# Altium schematic sheet MCU_buck.SchDoc: Buck Converter 20V 60W
size A4; Date: 25 FEB 2024; Author: Arturo S. Bayangos; Revision: V1.0; SheetNumber: 4; SheetTotal: 4
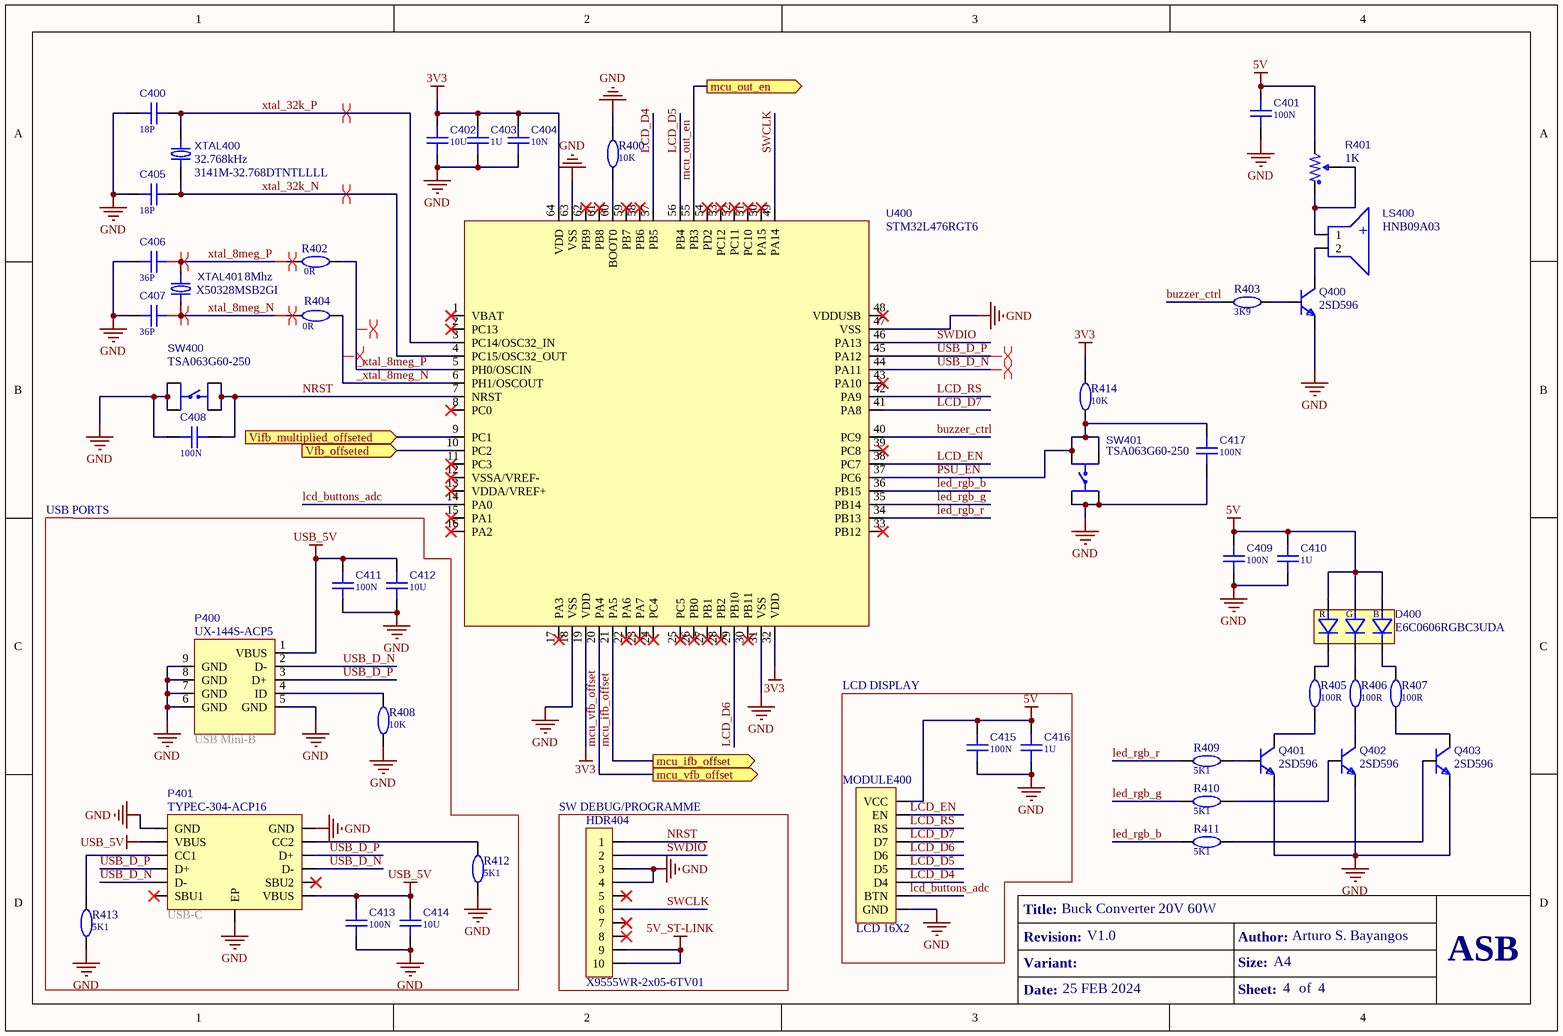
[diagram p0: MCU_buck.SchDoc]

## Parts
C400  value 18P  [CAP_0603]  (hidden comment: CAPACITOR)
C401  value 100N  [CAP_0402]  (hidden comment: CAPACITOR)
C402  value 10U  [CAP_1210]  (hidden comment: CAPACITOR)
C403  value 1U  [CAP_0603]  (hidden comment: CAPACITOR)
C404  value 10N  [CAP_0402]  (hidden comment: CAPACITOR)
C405  value 18P  [CAP_0603]  (hidden comment: CAPACITOR)
C406  value 36P  [CAP_0402]  (hidden comment: CAPACITOR)
C407  value 36P  [CAP_0402]  (hidden comment: CAPACITOR)
C408  value 100N  [CAP_0402]  (hidden comment: CAPACITOR)
C409  value 100N  [CAP_0402]  (hidden comment: CAPACITOR)
C410  value 1U  [CAP_0603]  (hidden comment: CAPACITOR)
C411  value 100N  [CAP_0402]  (hidden comment: CAPACITOR)
C412  value 10U  [CAP_1210]  (hidden comment: CAPACITOR)
C413  value 100N  [CAP_0402]  (hidden comment: CAPACITOR)
C414  value 10U  [CAP_1210]  (hidden comment: CAPACITOR)
C415  value 100N  [CAP_0402]  (hidden comment: CAPACITOR)
C416  value 1U  [CAP_0603]  (hidden comment: CAPACITOR)
C417  value 100N  [CAP_0402]  (hidden comment: CAPACITOR)
D400  value E6C0606RGBC3UDA  [LED_0603]  (hidden comment: LED_RGB_COMMON_P)
HDR404  value X9555WR-2x05-6TV01  [SOCKET_2X5P_2.54mm_HORZ_X9555WR]  (hidden comment: HEADER_2X5P_2.54mm)
LS400  value HNB09A03  [BUZZER_HNB09A03]  (hidden comment: BUZZER)
MODULE400  value LCD 16X2  [LCD_MODULE_16X2]  (hidden comment: LCD_MODULE_16X2)
P400  value UX-144S-ACP5  [USB_Mini-B_UX-144S-ACP5]  (hidden comment: USB_Mini-B)
P401  value TYPEC-304-ACP16  [USB-C_2.0_12PIN]  (hidden comment: USB-C_2.0)
Q400  value 2SD596  [SOT-23]  (hidden comment: BJT_NPN)
Q401  value 2SD596  [SOT-23]  (hidden comment: BJT_NPN)
Q402  value 2SD596  [SOT-23]  (hidden comment: BJT_NPN)
Q403  value 2SD596  [SOT-23]  (hidden comment: BJT_NPN)
R400  value 10K  [RES_0603]  (hidden comment: RESISTOR)
R401  value 1K  [RES_GF063P1-B102]  (hidden comment: RESISTOR_POT)
R402  value 0R  [RES_0402]  (hidden comment: RESISTOR)
R403  value 3K9  [RES_0603]  (hidden comment: RESISTOR)
R404  value 0R  [RES_0402]  (hidden comment: RESISTOR)
R405  value 100R  [RES_0603]  (hidden comment: RESISTOR)
R406  value 100R  [RES_0603]  (hidden comment: RESISTOR)
R407  value 100R  [RES_0603]  (hidden comment: RESISTOR)
R408  value 10K  [RES_0603]  (hidden comment: RESISTOR)
R409  value 5K1  [RES_0402]  (hidden comment: RESISTOR)
R410  value 5K1  [RES_0402]  (hidden comment: RESISTOR)
R411  value 5K1  [RES_0402]  (hidden comment: RESISTOR)
R412  value 5K1  [RES_0402]  (hidden comment: RESISTOR)
R413  value 5K1  [RES_0402]  (hidden comment: RESISTOR)
R414  value 10K  [RES_0603]  (hidden comment: RESISTOR)
SW400  value TSA063G60-250  [SMD_TSA063G60-250]  (hidden comment: SWITCH_SPST)
SW401  value TSA063G60-250  [SMD_TSA063G60-250]  (hidden comment: SWITCH_SPST)
U400  value STM32L476RGT6  [LQFP-64]  (hidden comment: MCU_STM32L476RGT6)
XTAL400  value 3141M-32.768DTNTLLLL  Frequency: 32.768kHz  [SMD_W1.5mm_L4.1mm_3141M-32.768DTNTLLLL]  (hidden comment: XTAL)
XTAL401  value X50328MSB2GI  Frequency: 8Mhz  [SMD_W3.2mm_L5.0m_X50328MSB2GI]  (hidden comment: XTAL)

## Blocks framed on the sheet
LCD DISPLAY: C415 C416 MODULE400
SW DEBUG/PROGRAMME: HDR404

## Ports
mcu_ifb_offset (out), mcu_out_en (out), mcu_vfb_offset (out), Vfb_offseted (in), Vifb_multiplied_offseted (in)

## Nets
3V3: C402.2 C403.2 C404.2 R414.2 U400.19(VDD) U400.32(VDD) U400.64(VDD)
5V: C401.2 C409.2 C410.2 C415.2 C416.2 D400.2(P) MODULE400.5(VCC) R401.3
5V_ST-LINK: HDR404.9 HDR404.10
GND: C400.1 C401.1 C402.1 C403.1 C404.1 C405.1 C406.1 C407.1 C408.1 C409.1 C410.1 C411.1 C412.1 C413.1 C414.1 C415.1 C416.1 C417.2 HDR404.3 HDR404.4 MODULE400.6(GND) P400.5(GND) P400.6(GND) P400.7(GND) P400.8(GND) P400.9(GND) P401.A1B12(GND) P401.B1A12(GND) P401.EP Q400.2(E) Q401.2(E) Q402.2(E) Q403.2(E) R400.2 R408.1 R412.2 R413.2 SW400.3 SW400.4 SW401.3 SW401.4 U400.18(VSS) U400.31(VSS) U400.47(VSS) U400.63(VSS)
USB_5V: C411.2 C412.2 C413.2 C414.2 P400.1(VBUS) P401.A4B9(VBUS) P401.B4A9(VBUS)
_xtal_8meg_N: R404.2 U400.6(PH1/OSCOUT)
_xtal_8meg_P: R402.2 U400.5(PH0/OSCIN)
buzzer_ctrl: R403.1 U400.40(PC9)
lcd_buttons_adc: MODULE400.7(BTN) U400.14(PA0)
LCD_D4: MODULE400.17(D4) U400.57(PB5)
LCD_D5: MODULE400.18(D5) U400.56(PB4)
LCD_D6: MODULE400.19(D6) U400.29(PB10)
LCD_D7: MODULE400.20(D7) U400.41(PA8)
LCD_EN: MODULE400.22(EN) U400.38(PC7)
LCD_RS: MODULE400.21(RS) U400.42(PA9)
led_rgb_b: R411.1 U400.36(PB15)
led_rgb_g: R410.1 U400.35(PB14)
led_rgb_r: R409.1 U400.34(PB13)
mcu_ifb_offset: U400.21(PA5) ; port mcu_ifb_offset
mcu_out_en: U400.55(PB3) ; port mcu_out_en
mcu_vfb_offset: U400.20(PA4) ; port mcu_vfb_offset
NRST: C408.2 HDR404.1 SW400.1 SW400.2 U400.7(NRST)
PSU_EN: C417.1 R414.1 SW401.1 SW401.2 U400.37(PC6)
SWCLK: HDR404.6 U400.49(PA14)
SWDIO: HDR404.2 U400.46(PA13)
USB_D_N: P400.2(D-) P401.A7(D-) P401.B7(D-) U400.44(PA11)
USB_D_P: P400.3(D+) P401.A6(D+) P401.B6(D+) U400.45(PA12)
Vfb_offseted: U400.10(PC2) ; port Vfb_offseted
Vifb_multiplied_offseted: U400.9(PC1) ; port Vifb_multiplied_offseted
xtal_8meg_N: C407.2 R404.1 XTAL401.1
xtal_8meg_P: C406.2 R402.1 XTAL401.2
xtal_32k_N: C405.2 U400.4(PC15/OSC32_OUT) XTAL400.2
xtal_32k_P: C400.2 U400.3(PC14/OSC32_IN) XTAL400.1
NetD400_1: D400.1(B) R407.2
NetD400_3: D400.3(G) R406.2
NetD400_4: D400.4(R) R405.2
NetLS400_1: LS400.1 R401.1 R401.2
NetLS400_2: LS400.2 Q400.3(C)
NetP400_4: P400.4(ID) R408.2
NetP401_A5: P401.A5(CC1) R413.1
NetP401_B5: P401.B5(CC2) R412.1
NetQ400_1: Q400.1(B) R403.2
NetQ401_1: Q401.1(B) R409.2
NetQ401_3: Q401.3(C) R405.1
NetQ402_1: Q402.1(B) R410.2
NetQ402_3: Q402.3(C) R406.1
NetQ403_1: Q403.1(B) R411.2
NetQ403_3: Q403.3(C) R407.1
NetR400_1: R400.1 U400.60(BOOT0)

Not connected (* = marked no-connect by the designer): HDR404 5* 7* 8*; P401 A8(SBU1)* B8(SBU2)*; U400 1(VBAT)* 2(PC13)* 8(PC0)* 11(PC3)* 12(VSSA/VREF-)* 13(VDDA/VREF+)* 15(PA1)* 16(PA2)* 17(PA3)* 22(PA6)* 23(PA7)* 24(PC4)* 25(PC5)* 26(PB0)* 27(PB1)* 28(PB2)* 30(PB11)* 33(PB12)* 39(PC8)* 43(PA10)* 48(VDDUSB)* 50(PA15)* 51(PC10)* 52(PC11)* 53(PC12)* 54(PD2)* 58(PB6)* 59(PB7)* 61(PB8)* 62(PB9)*

## Layout directives
differential pair: (no net found under the mark), _xtal_8meg_N, _xtal_8meg_P, USB_D_N, USB_D_P, xtal_8meg_N, xtal_8meg_P, xtal_32k_N, xtal_32k_P

## Notes on the sheet
- USB PORTS
- (near P400) USB Mini-B
- (near P401) USB-C
- Title:
- Revision:
- Variant:
- Size:
- Author:
- A4
- ASB
- Date:
- Sheet:
- of
- (in symbol HNB09A03) +

## Library data of the parts
C400 C405 = CC0603JRNPO9BN180: CAP 18P 0603 NPO 50V 5%; Manifacturer: YAGEO; Part Number: CC0603JRNPO9BN180; ComponentLink1Description: Datasheet; ComponentLink1URL: https://datasheet.lcsc.com/lcsc/2304140030_YAGEO-CC0603JRNPO9BN180_C107040.pdf; ComponentLink2Description: Characteristics; Package: 0603
C401 C408 C409 C411 C413 C415 C417 = UMK105B7104KV-FR: CAP 100N 0402 X7R 50V 10%; Manifacturer: Taiyo Yuden; Part Number: UMK105B7104KV-FR; ComponentLink1Description: Datasheet; ComponentLink1URL: https://datasheet.lcsc.com/lcsc/2211282030_Taiyo-Yuden-UMK105B7104KV-FR_C2167491.pdf; ComponentLink2Description: Characteristics; ComponentLink2URL: Datasheets\Capacitors\UMK105B7104KV-FR_TaiyoYuden.pdf; Package: 0402
C402 C412 C414 = UMK325AB7106KM-T: CAP 10U 1210 X7R 50V 10%; Manifacturer: Taiyo Yuden; Part Number: UMK325AB7106KM-T; ComponentLink1Description: Datasheet; ComponentLink1URL: https://datasheet.lcsc.com/lcsc/2211282230_Taiyo-Yuden-UMK325AB7106KM-T_C386167.pdf; ComponentLink2Description: Characteristics; ComponentLink2URL: Datasheets\Capacitors\UMK325AB7106KM-T_TaiyoYuden_Char.pdf; Package: 1210
C403 C410 C416 = TMK107AB7105KAHT: CAP 1U 0603 X7R 25V 10%; Manifacturer: Taiyo Yuden; Part Number: TMK107AB7105KAHT; ComponentLink1Description: Datasheet; ComponentLink1URL: https://datasheet.lcsc.com/lcsc/1912111437_Taiyo-Yuden-TMK107AB7105KAHT_C386079.pdf; ComponentLink2Description: Characteristics; ComponentLink2URL: Datasheets\Capacitors\TMK107AB7105KAHT_TaiyoYuden.pdf; Package: 0603
C404 = UMF105B7103KVHF: CAP 10N 0402 X7R 50V 10%; Manifacturer: Taiyo Yuden; Part Number: UMF105B7103KVHF; ComponentLink1Description: Datasheet; ComponentLink1URL: https://datasheet.lcsc.com/lcsc/1912111437_Taiyo-Yuden-UMF105B7103KVHF_C386105.pdf; ComponentLink2Description: Characteristics; ComponentLink2URL: Datasheets\Capacitors\UMF105B7103KVHF_TaiyoYuden.pdf; Package: 0402
C406 C407 = CC0603JRNPO9BN360: CAP 36P 0402 NPO 50V 5%; Manifacturer: YAGEO; Part Number: CC0603JRNPO9BN360; ComponentLink1Description: Datasheet; ComponentLink1URL: https://datasheet.lcsc.com/lcsc/2304140030_YAGEO-CC0603JRNPO9BN360_C134070.pdf; Package: 402
D400 = E6C0606RGBC3UDA: LED E6C0606RGBC3UDA 0603 RGB 5V 20mA; Forward voltage: 2.20V (max, red), 3.40V (max , green), 3.40V (max, blue); Manifacturer: EKINGLUX; Part Number: E6C0606RGBC3UDA; Package: 0603; Type: RGB; Current: 20mA; Voltage: 5V; Operating temperature: 90 ℃; ComponentLink1Description: Datasheet; ComponentLink1URL: https://datasheet.lcsc.com/lcsc/2203301730_EKINGLUX-E6C0606RGBC3UDA_C375569.pdf
HDR404 = X9555WR-2x05-6TV01: SOCKET / X9555WR-2x05-6TV01 TH 2.54mm 2X5P HORZ; Current: 3A; Manifacturer: XKB Connectivity; Part Number: X9555WR-2x05-6TV01; Package: TH; Pitch: 2.54mm; Voltage: N/A; Structure: 2X5P HORZ; Supported protocol: N/A; ComponentLink1Description: Datasheet; ComponentLink1URL: https://datasheet.lcsc.com/lcsc/2110112030_XKB-Connectivity-X9555WR-2x05-6TV01_C2682217.pdf
LS400 = HNB09A03: BUZZER HNB09A03 TH 1.5V-5V 3Khz; Current: 30mA; Supply Voltage: 1.5V - 4.5V; Tj: 20℃~+70℃; Manifacturer: Jiangsu Huaneng Elec; Part Number: HNB09A03; Package: TH; ComponentLink1Description: Datasheet; ComponentLink1URL: https://datasheet.lcsc.com/lcsc/1811141116_Jiangsu-Huaneng-Elec-HNB09A03_C96102.pdf; ComponentLink2Description: Characteristics
MODULE400 = LCD_16X2_Arduino_Shield: LCD Display 16X2 Arduino Shield; Part Number: LCD_16X2_Arduino_Shield; ComponentLink1Description: Datasheet; ComponentLink1URL: NA
P400 = UX-144S-ACP5: CONN UX-144S-ACP5 SMD USB_Mini-B 2.0; Current: 1.5A; Structure: USB Mini-B; Supported protocol: USB 2.0; Manifacturer: XUNPU; Part Number: UX-144S-ACP5; Package: SMD; Pitch: N/A; Voltage: N/A; ComponentLink1Description: Datasheet; ComponentLink1URL: https://datasheet.lcsc.com/lcsc/2008122036_XUNPU-UX-144S-ACP5_C720611.pdf
P401 = TYPEC-304-ACP16: CONN TYPEC-304-ACP16 SMD USB-C 2.0; Current: 3A; Supported protocol: USB 2.0; Manifacturer: XUNPU; Part Number: TYPEC-304-ACP16; Package: SMD; Pitch: N/A; Voltage: N/A; Structure: USB-C; ComponentLink1Description: Datasheet; ComponentLink1URL: https://datasheet.lcsc.com/lcsc/2203111830_XUNPU-TYPEC-304-ACP16_C2982555.pdf
Q400-Q403 = 2SD596: NPN 2SD596 SOT-23 25V 0.2W; VEBO: 5V; Tjmax: 150 °C; Manifacturer: YONGYUTAI; ComponentLink1Description: Datasheet; ComponentLink1URL: https://datasheet.lcsc.com/lcsc/2109011130_YONGYUTAI-2SD596_C2891824.pdf; Part Number: 2SD596; Package: SOT-23; VCEO: 25V; Power: 0.2W
R400 R408 R414 = ARG03BTC1002: RES 10K 0603 0.1W 0.1% 75V; Manifacturer: Viking Tech; Part Number: ARG03BTC1002; ComponentLink1Description: Datasheet; ComponentLink1URL: Datasheets\Resistors\ARG03BTC1002_VikingTech.pdf; ComponentLink2Description: Characteristics; Package: 0603
R401 = GF063P1-B102: RES POT 1K TH 20%; Manifacturer: Tokyo Cosmos Elec; ComponentLink1Description: Datasheet; ComponentLink1URL: https://datasheet.lcsc.com/lcsc/2304140030_Tokyo-Cosmos-Elec-GF063P1-B102_C128078.pdf; ComponentLink2Description: Characteristics; Part Number: GF063P1-B102; Package: TH
R402 R404 = 0402WGF0000TCE: RES 0R 0402 1% 0.625W; Manifacturer: UNI-ROYAL(Uniroyal Elec); Part Number: 0402WGF0000TCE; ComponentLink1Description: Datasheet; ComponentLink1URL: https://datasheet.lcsc.com/lcsc/2206010216_UNI-ROYAL-Uniroyal-Elec-0402WGF0000TCE_C17168.pdf; Package: 402
R403 = RC0603FR-073K9L: RES 3K9 0603 1% 0.1W 75V; Manifacturer: YAGEO; Part Number: RC0603FR-073K9L; ComponentLink1Description: Datasheet; ComponentLink1URL: https://datasheet.lcsc.com/lcsc/2304140030_YAGEO-RC0603FR-073K9L_C114616.pdf; ComponentLink2Description: Characteristics; Package: 0603
R405-R407 = RT0603CRE07100RL: RES 100R 00603 0.1W 0.25% 75V; Manifacturer: YAGEO; Part Number: RT0603CRE07100RL; ComponentLink1Description: Datasheet; ComponentLink1URL: Datasheets\Resistors\RT0603CRE07100RL_Yageo.pdf; ComponentLink2Description: Characteristics; Package: 0604
R409-R413 = RC0402FR-075K1L: RES 5K1 0402 1% 0.625W 50V; Manifacturer: YAGEO; Part Number: RC0402FR-075K1L; ComponentLink1Description: Datasheet; ComponentLink1URL: https://datasheet.lcsc.com/lcsc/2304140030_YAGEO-RC0402FR-075K1L_C105872.pdf; Package: 402
SW400 SW401 = TSA063G60-250: SW / TSA063G60-250 SMD SPST 50mA 12V; Manifacturer: BRIGHT; Part Number: TSA063G60-250; Package: SMD; Type: SPST; Current: 50mA; Voltage: 12V; Operating temperature: -25℃~+70℃; ComponentLink1Description: Datasheet; ComponentLink1URL: https://datasheet.lcsc.com/lcsc/2304140030_BRIGHT-TSA063G60-250_C294566.pdf
U400 = STM32L476RGT6: IC STM32L476RGT6 LQFP-64 MCU; Supply Voltage: 1.71V - 3.6V; Tj: 85 ℃; Manifacturer: STMicroelectronics; Part Number: STM32L476RGT6; Package: LQFP-64; Type: MCU; ComponentLink1Description: Datasheet; ComponentLink1URL: https://datasheet.lcsc.com/lcsc/2304140030_STMicroelectronics-STM32L476RGT6_C74797.pdf; ComponentLink2Description: Characteristics
XTAL400 = 3141M-32.768DTNTLLLL: XTAL 3141M-32.768DTNTLLLL SMD_W1.5mm_L4.1mm 32.768kHz 12.5pF; Drive level: 0.2uW (typ), 1uW(max); ESR: <60kΩ; Frequency tolerance: ±20ppm / ±30ppm / ±50ppm; Co(shunt capacitance): 1.5pF (typ); C1(motional capacitance): 3.3fF(typ); Manifacturer: HCI; Part Number: 3141M-32.768DTNTLLLL; Package: SMD_W1.5mm_L4.1mm; Load Capacitance: 12.5pF; Operating temperature: –40 to +85°C; ComponentLink1Description: Datasheet; ComponentLink1URL: https://datasheet.lcsc.com/lcsc/2311151637_HCI-3141M-32-768DTNTLLLL_C7503638.pdf
XTAL401 = X50328MSB2GI: XTAL / X50328MSB2GI SMD_W3.2mm_L5.0mm 8Mhz 20pF; Drive level: 100uW(typ); ESR: 80Ω; Frequency tolerance: ±30ppm; Co(shunt capacitance): 3pF; Manifacturer: YXC; Part Number: X50328MSB2GI; Package: SMD_W3.2mm_L5.0m; Load Capacitance: 20pF; C1(motional capacitance): N/A; Operating temperature: –40 to +125°C; ComponentLink1Description: Datasheet; ComponentLink1URL: https://datasheet.lcsc.com/lcsc/2302201101_YXC-X50328MSB2GI_C115962.pdf